# Altium schematic sheet USB.SchDoc
size A
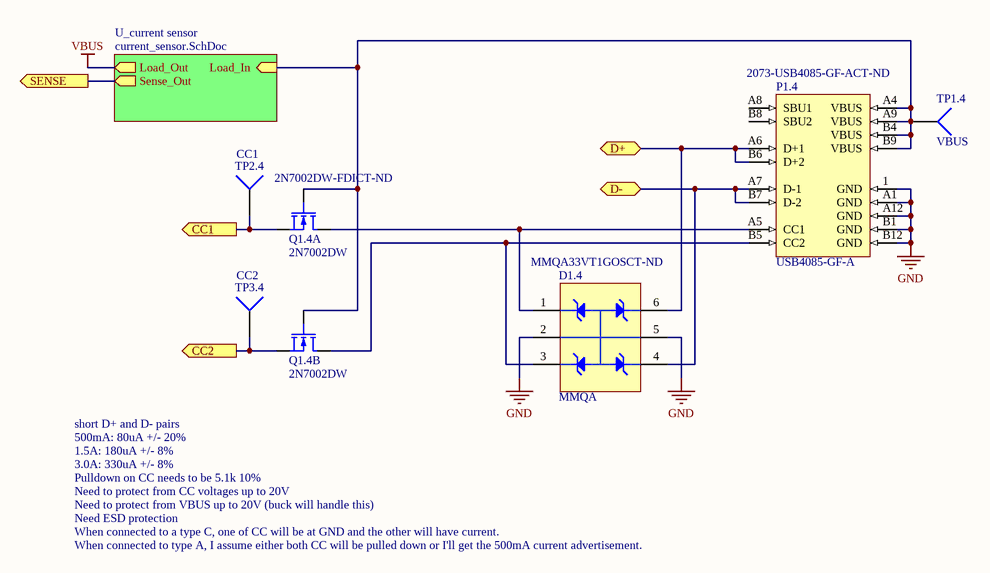
[diagram p0: USB.SchDoc]

## Parts
D1.4  MMQA  Supplier Part Number 1: MMQA33VT1GOSCT-ND  [SC-74]
P1.4  USB4085-GF-A  Supplier Part Number 1: 2073-USB4085-GF-ACT-ND  [USB4085-GF-A]
Q1.4  2N7002DW  Supplier Part Number 1: 2N7002DW-FDICT-ND  [SOT65P210X110-6N]  (parts A,B of 2)
TP1.4  VBUS  [Test Point Target 1mm]  (no BOM)
TP2.4  CC1  [Test Point Target 1mm]  (no BOM)
TP3.4  CC2  [Test Point Target 1mm]  (no BOM)

## Sub-sheets
U_current sensor = current_sensor.SchDoc: Load_In (in), Load_Out (out), Sense_Out (out)

## Ports
CC1 (out), CC2 (out), D+ (bidir), D- (bidir), SENSE (out)

## Nets
GND: D1.4.2 D1.4.5 P1.4.1(GND) P1.4.A1(GND) P1.4.A12(GND) P1.4.B1(GND) P1.4.B12(GND)
VBUS: sheet U_current sensor/Load_Out
CC1: Q1.4.4(S) TP2.4.1 ; port CC1
CC2: Q1.4.1(S) TP3.4.1 ; port CC2
D+: D1.4.6 P1.4.A6(D+1) P1.4.B6(D+2) ; port D+
D-: D1.4.4 P1.4.A7(D-1) P1.4.B7(D-2) ; port D-
SENSE: port SENSE, sheet U_current sensor/Sense_Out
NetD1.4_1: D1.4.1 P1.4.A5(CC1) Q1.4.3(D)
NetD1.4_3: D1.4.3 P1.4.B5(CC2) Q1.4.6(D)
NetP1.4_A4: P1.4.A4(VBUS) P1.4.A9(VBUS) P1.4.B4(VBUS) P1.4.B9(VBUS) Q1.4.2(G) Q1.4.5(G) TP1.4.1 ; sheet U_current sensor/Load_In

Not connected (* = marked no-connect by the designer): P1.4 A8(SBU1) B8(SBU2)

## Notes on the sheet
- short D+ and D- pairs
- Need to protect from CC voltages up to 20V
- 500mA: 80uA +/- 20%
- 1.5A: 180uA +/- 8%
- 3.0A: 330uA +/- 8%
- Pulldown on CC needs to be 5.1k 10%
- Need to protect from VBUS up to 20V (buck will handle this)
- When connected to a type C, one of CC will be at GND and the other will have current.
- When connected to type A, I assume either both CC will be pulled down or I'll get the 500mA current advertisement.
- Need ESD protection

## Library data of the parts
P1.4 = USB4085-GF-A: USB C Connector; Supplier 1: Digi-Key
TP1.4 TP2.4 TP3.4 = Socket: LatestRevisionDate: 17-Jul-2002; LatestRevisionNote: Re-released for DXP Platform.; Publisher: Altium Limited
D1.4 = MMQA: Supplier 1: Digi-Key
Q1.4 = 2N7002DW: Supplier 1: Digi-Key